# Altium schematic sheet [29] - POWER SEQUENCING.SchDoc
size A2; DocumentNumber: 29; SheetNumber: 29; SheetTotal: 31
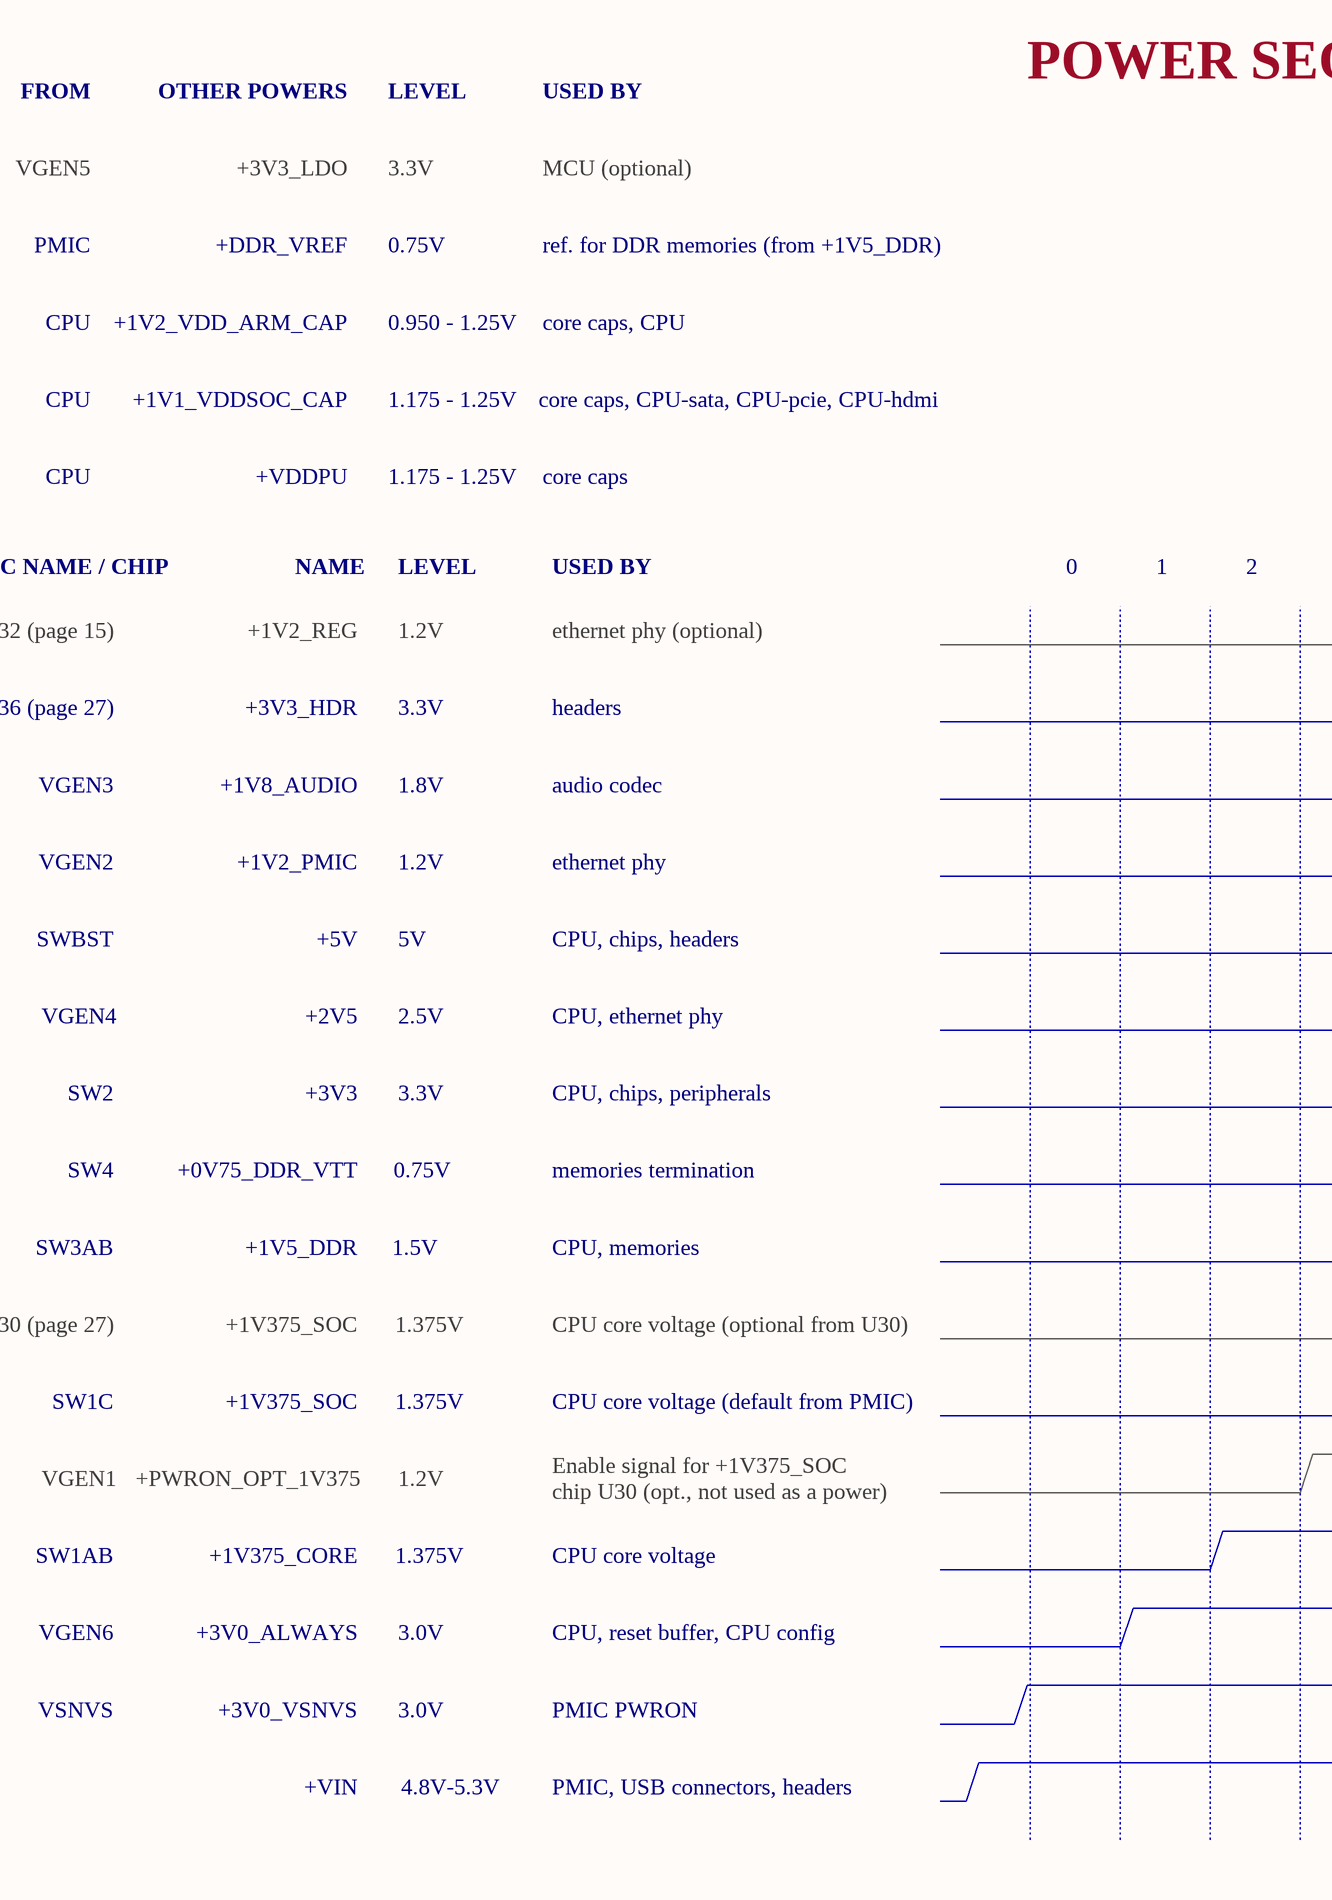
[diagram p0: [29] - POWER SEQUENCING.SchDoc, left]
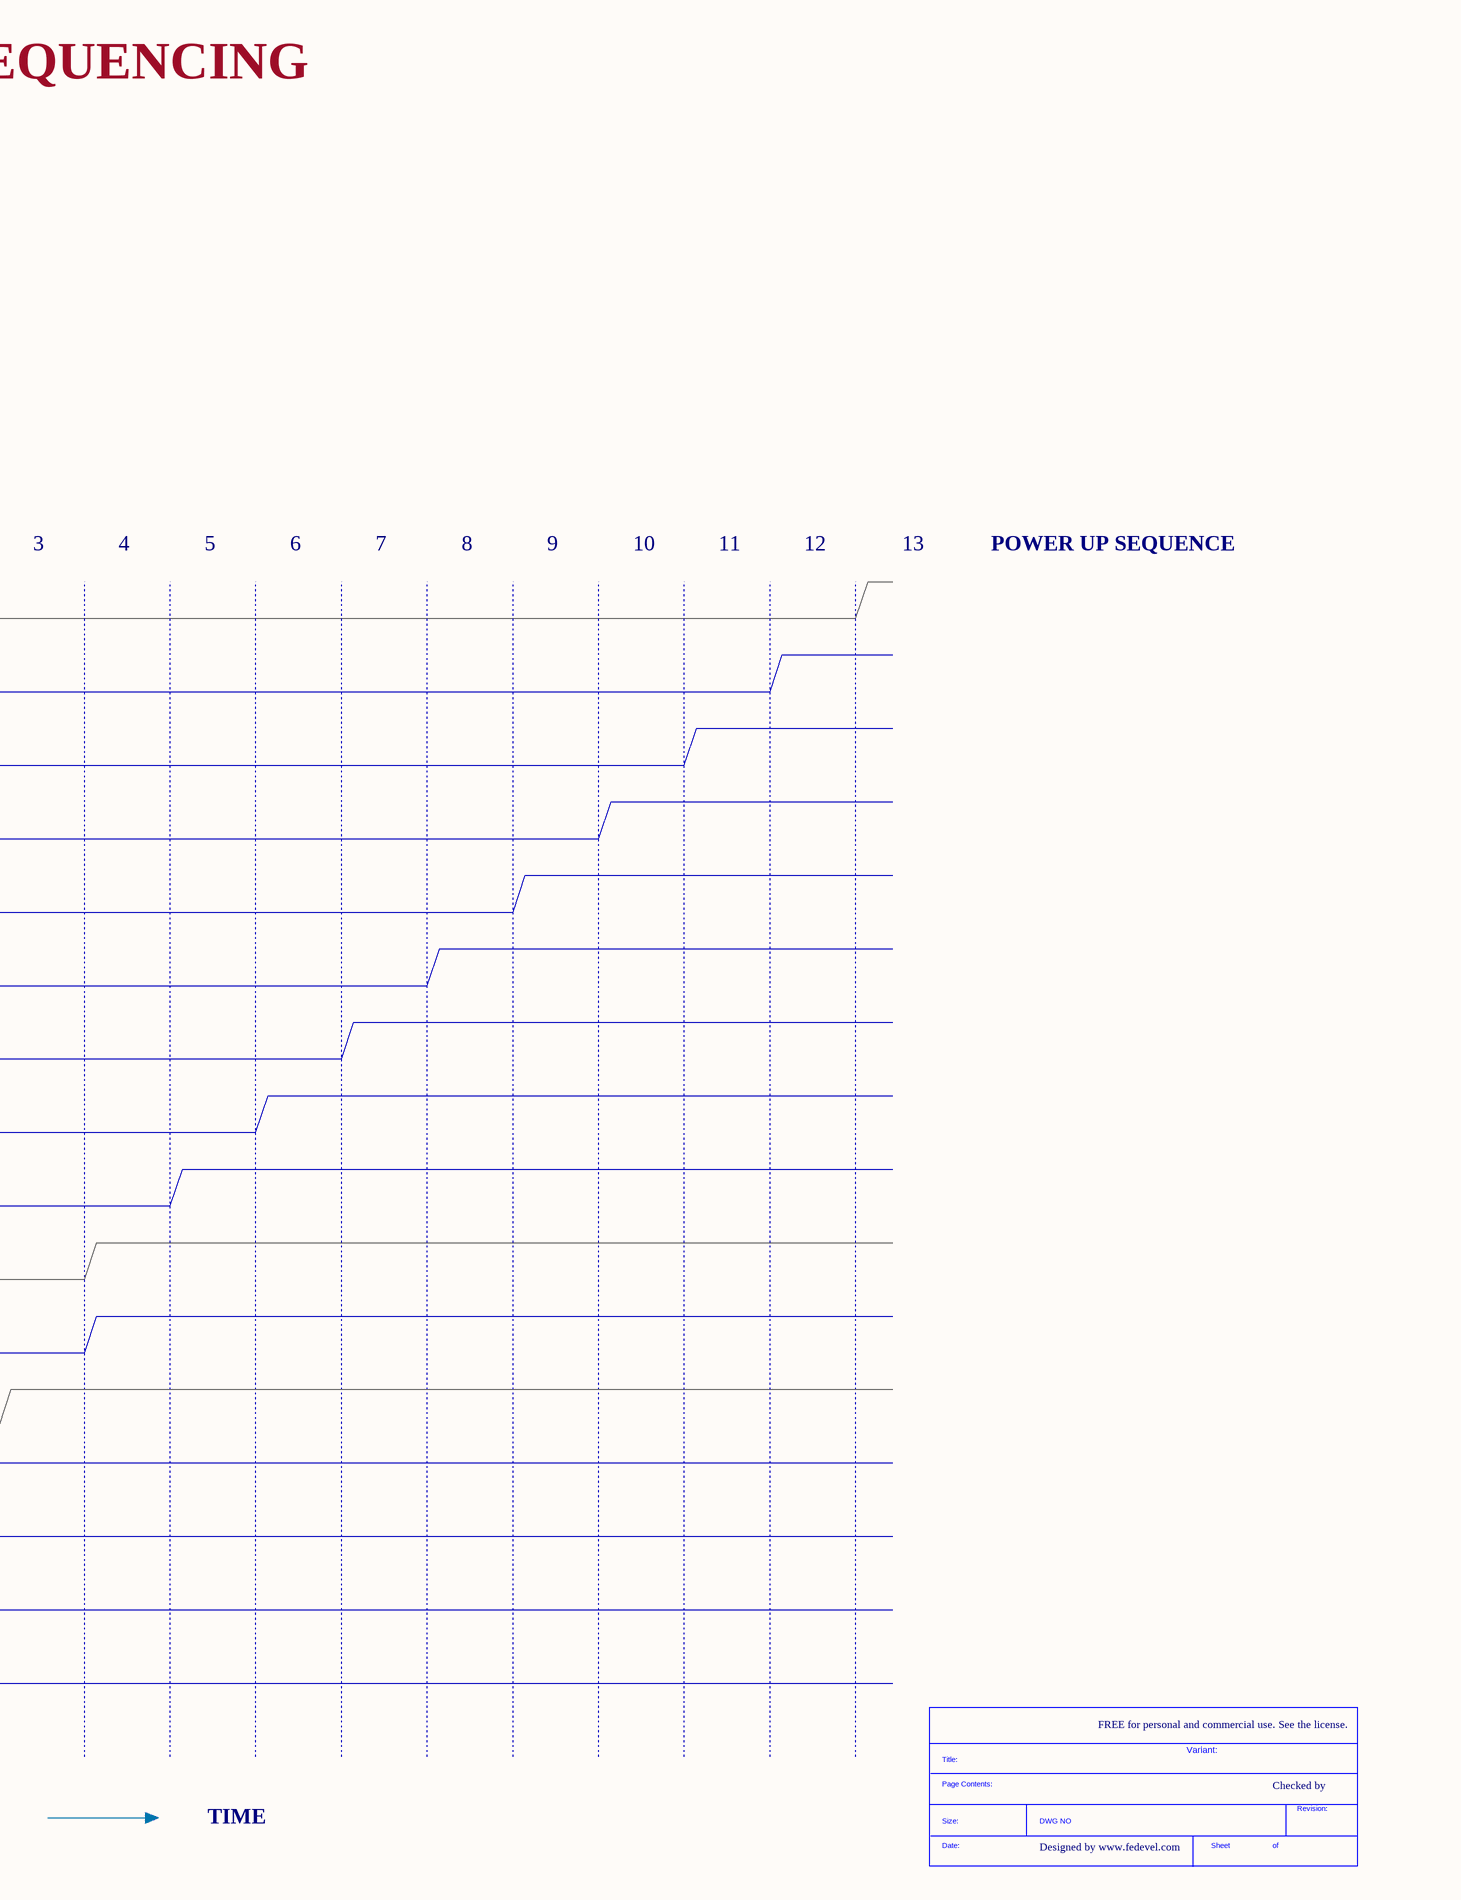
[diagram p1: [29] - POWER SEQUENCING.SchDoc, right]

## Parts
*  SDTitleBlock  (value not drawn)  (graphical)

## Notes on the sheet
- POWER SEQUENCING
- FROM
- OTHER POWERS
- LEVEL
- USED BY
- VGEN5
- +3V3_LDO
- 3.3V
- MCU (optional)
- PMIC
- +DDR_VREF
- 0.75V
- ref. for DDR memories (from +1V5_DDR)
- CPU
- +1V2_VDD_ARM_CAP
- 0.950 - 1.25V
- core caps, CPU
- +1V1_VDDSOC_CAP
- 1.175 - 1.25V
- core caps, CPU-sata, CPU-pcie, CPU-hdmi
- +VDDPU
- core caps
- PMIC NAME / CHIP
- NAME
- 0
- 1
- 2
- 3
- 4
- 5
- 6
- 7
- 8
- 9
- 10
- 11
- 12
- 13
- POWER UP SEQUENCE
- U32 (page 15)
- +1V2_REG
- 1.2V
- ethernet phy (optional)
- U36 (page 27)
- +3V3_HDR
- headers
- VGEN3
- +1V8_AUDIO
- 1.8V
- audio codec
- VGEN2
- +1V2_PMIC
- ethernet phy
- SWBST
- +5V
- 5V
- CPU, chips, headers
- VGEN4
- +2V5
- 2.5V
- CPU, ethernet phy
- SW2
- +3V3
- CPU, chips, peripherals
- SW4
- +0V75_DDR_VTT
- memories termination
- SW3AB
- +1V5_DDR
- 1.5V
- CPU, memories
- U30 (page 27)
- +1V375_SOC
- 1.375V
- CPU core voltage (optional from U30)
- SW1C
- CPU core voltage (default from PMIC)
- VGEN1
- +PWRON_OPT_1V375
- Enable signal for +1V375_SOC
- chip U30 (opt., not used as a power)
- SW1AB
- +1V375_CORE
- CPU core voltage
- VGEN6
- +3V0_ALWAYS
- 3.0V
- CPU, reset buffer, CPU config
- VSNVS
- +3V0_VSNVS
- PMIC PWRON
- +VIN
- 4.8V-5.3V
- PMIC, USB connectors, headers
- FREE for personal and commercial use. See the license.
- Variant:
- Checked by
- TIME
- Designed by www.fedevel.com
- (in symbol SDTitleBlock) Title:; Page Contents:; Revision:; Size:; DWG NO; Date:; Sheet; of